# EAGLE design battery_charger (EAGLE 6.2)
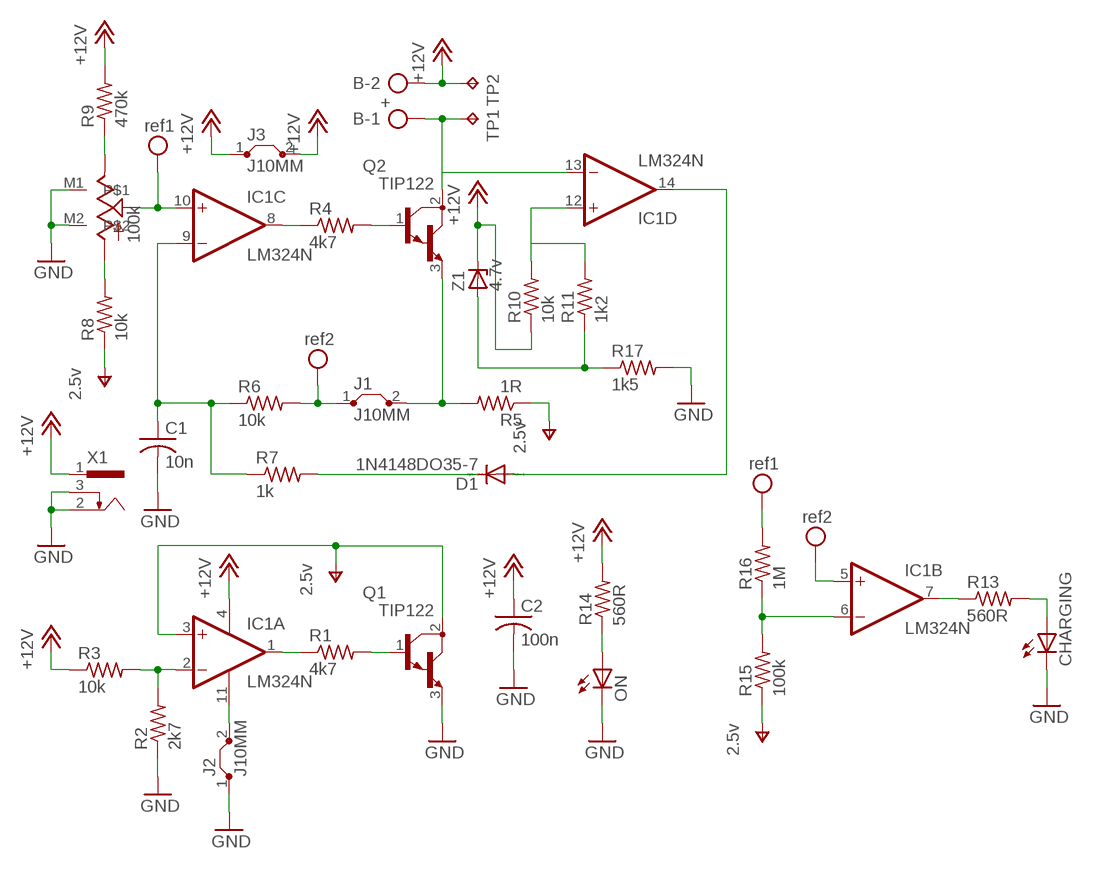
[diagram p0: schematic, sheet 1]

## Parts
B  +  AK500/2  [AK500/2]
C1  10n  C-US050-025X075  [C050-025X075]
C2  100n  C-US050-025X075  [C050-025X075]
CHARGING  LED5MM  [LED5MM]
D1  1N4148DO35-7  [DO35-7]
IC1  LM324N  [DIL14]
J1  J10MM  [10]
J2  J10MM  [10]
J3  J10MM  [10]
ON  LED5MM  [LED5MM]
Q1  TIP122  [TO220V]
Q2  TIP122  [TO220V]
R1  4k7  R-US_0207/7  [0207/7]
R2  2k7  R-US_0207/7  [0207/7]
R3  10k  R-US_0207/7  [0207/7]
R4  4k7  R-US_0207/7  [0207/7]
R5  1R  R-US_0922/22  [0922/22]
R6  10k  R-US_0207/7  [0207/7]
R7  1k  R-US_0207/7  [0207/7]
R8  10k  R-US_0207/7  [0207/7]
R9  470k  R-US_0207/7  [0207/7]
R10  10k  R-US_0207/7  [0207/7]
R11  1k2  R-US_0207/7  [0207/7]
R12  100k  US-EVUF3M  [EVUFXM]
R13  560R  R-US_0207/7  [0207/7]
R14  560R  R-US_0207/7  [0207/7]
R15  100k  R-US_0207/7  [0207/7]
R16  1M  R-US_0207/7  [0207/7]
R17  1k5  R-US_0207/7  [0207/7]
TP1  TPPAD1-13  [P1-13]
TP2  TPPAD1-13  [P1-13]
X1  733980-62  [733980-62]
Z1  4.7v  ZENER-DIODEDO34-7  [DO34Z7]

## Nets
+12V: B.2 C2.1 IC1.4(P:V+) J3.1 J3.2 R3.1 R9.2 R10.1 R14.2 TP2.TP X1.1 Z1.C
GND: C1.2 C2.2 CHARGING.K(C) J2.1 ON.K(C) Q1.3(E) R2.1 R12.M1 R12.M2 R17.2 X1.2 X1.3
N$1: IC1.1(A:OUT) R1.1
N$2: Q1.1(B) R1.2
N$3: IC1.8(C:OUT) R4.1
N$4: IC1.2(A:-IN) R2.2 R3.2
N$5: Q2.1(B) R4.2
N$6: ON.A R14.1
N$7: R11.1 R17.1 Z1.A
N$8: B.1 IC1.13(D:-IN) Q2.2(C) TP1.TP
N$9: C1.1 IC1.9(C:-IN) R6.1 R7.1
N$10: D1.C R7.2
N$11: D1.A IC1.14(D:OUT)
N$12: R8.2 R12.1(A)
N$13: CHARGING.A R13.2
N$14: R9.1 R12.3(E)
N$15: IC1.7(B:OUT) R13.1
N$16: IC1.6(B:-IN) R15.2 R16.1
N$21: IC1.11(P:V-) J2.2
N$22: J1.2 Q2.3(E) R5.2
N$23: IC1.12(D:+IN) R10.2 R11.2
V-: IC1.3(A:+IN) Q1.2(C) R5.1 R8.1 R15.1 ; supply symbol labelled 2.5v
VCC: IC1.10(C:+IN) R12.2(S) R16.2 ; supply symbol labelled ref1
VEE: IC1.5(B:+IN) J1.1 R6.2 ; supply symbol labelled ref2

## Library data of the parts
B = con-ptr500:AK500/2: CONNECTOR; OC_FARNELL: unknown; OC_NEWARK: unknown
C1 C2 = rcl:C-US: CAPACITOR, American symbol
CHARGING ON = led:LED: LED OSRAM: - CHIPLED LG R971, LG N971, LY N971, LG Q971, LY Q971, LO R971, LY R971 LH N974, LH R974 LS Q976, LO Q976, LY Q976 LO Q996 - Hyper CHIPLED LW Q18S LB Q993, LB Q99A, LB R99A - SideLED LS A670, LO A670, LY A670, LG A670, LP A670 LB A673, LV A673, LT A673, LW A673 LH A674 LY A675 LS A676, LA A676, LO A676, LY A676, LW A676 LS A679, LY A679, LG A679 - Hyper Micro SIDELED® LS Y876, LA Y876, LO Y876, LY Y876 LT Y87S - SmartLED LW L88C, LW L88S LB L89C, LB L89S, LG L890 LS L89K, LO L89K, LY L89K LS L896, LA L896, LO L896, LY L896 - TOPLED LS T670, LO T670, LY T670, LG T670, LP T670 LSG T670, LSP T670, LSY T670, LOP T670, LYG T670 LG T671, LOG T671, LSG T671 LB T673, LV T673, LT T673, LW T673 LH T674 LS T676, LA T676, LO T676, LY T676, LB T676, LH T676, LSB T676, LW T676 LB T67C, LV T67C, LT T67C, LS T67K, LO T67K, LY T67K, LW E67C LS E67B, LA E67B, LO E67B, LY E67B, LB E67C, LV E67C, LT E67C LW T67C LS T679, LY T679, LG T679 LS T770, LO T770, LY T770, LG T770, LP T770 LB T773, LV T773, LT T773, LW T773 LH T774 LS E675, LA E675, LY E675, LS T675 LS T776, LA T776, LO T776, LY T776, LB T776 LHGB T686 LT T68C, LB T68C - Hyper Mini TOPLED® LB M676 - Mini TOPLED Santana® LG M470 LS M47K, LO M47K, LY M47K Source: http://www.osram.convergy.de LUXEON: - LUMILED® LXK2-PW12-R00, LXK2-PW12-S00, LXK2-PW14-U00, LXK2-PW14-V00 LXK2-PM12-R00, LXK2-PM12-S00, LXK2-PM14-U00 LXK2-PE12-Q00, LXK2-PE12-R00, LXK2-PE12-S00, LXK2-PE14-T00, LXK2-PE14-U00 LXK2-PB12-K00, LXK2-PB12-L00, LXK2-PB12-M00, LXK2-PB14-N00, LXK2-PB14-P00, LXK2-PB14-Q00 LXK2-PR12-L00, LXK2-PR12-M00, LXK2-PR14-Q00, LXK2-PR14-R00 LXK2-PD12-Q00, LXK2-PD12-R00, LXK2-PD12-S00 LXK2-PH12-R00, LXK2-PH12-S00 LXK2-PL12-P00, LXK2-PL12-Q00, LXK2-PL12-R00 Source: www.luxeon.com KINGBRIGHT: KA-3528ASYC Source: www.kingbright.com
D1 = diode:1N4148: DIODE high speed (Philips)
IC1 = linear:LM324: OP AMP
J1-J3 = jumper:J: Bridge
Q1 Q2 = transistor-npn:TIP122*: NPN Darlington Transistor
R1-R11 R13-R17 = rcl:R-US_: RESISTOR, American symbol
R12 = pot:US-EVU: 9 mm Square Rotary Potentiometers Source: Panasonic
TP1 TP2 = testpad:TP: Test pad
X1 = con-conrad:73398?: FEMALE PRINT CONNECTOR Niedervolt-Steckverbinder Distributor Conrad
Z1 = diode:ZENER-DIODE: Z-Diode

## Board
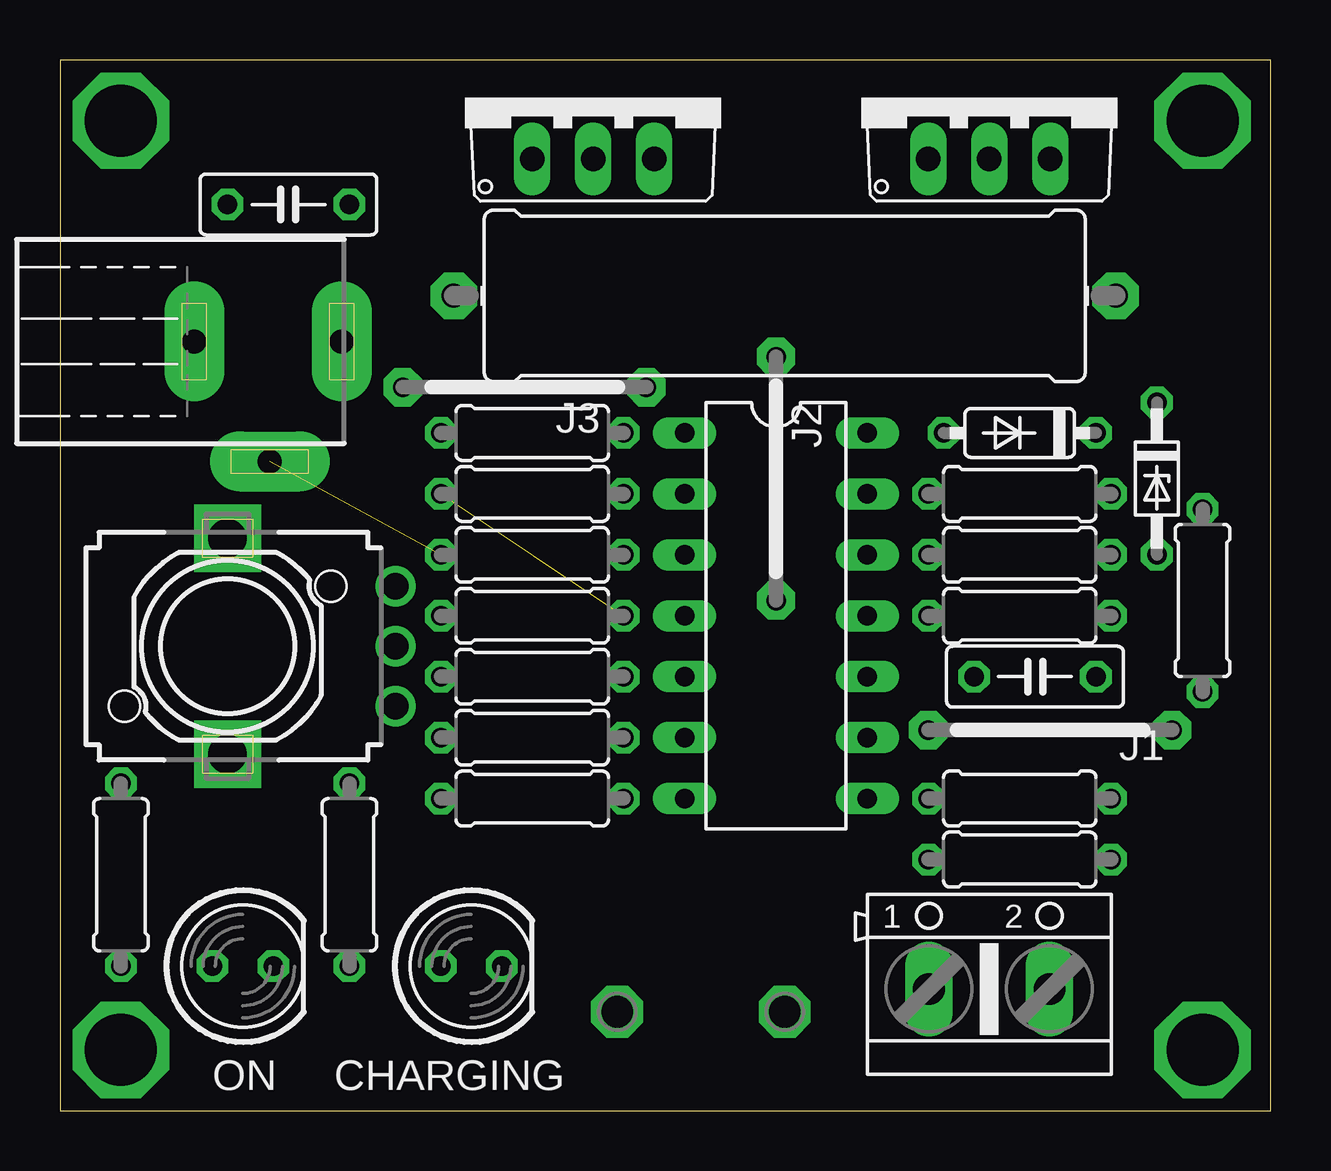
[diagram p1: board, top side]
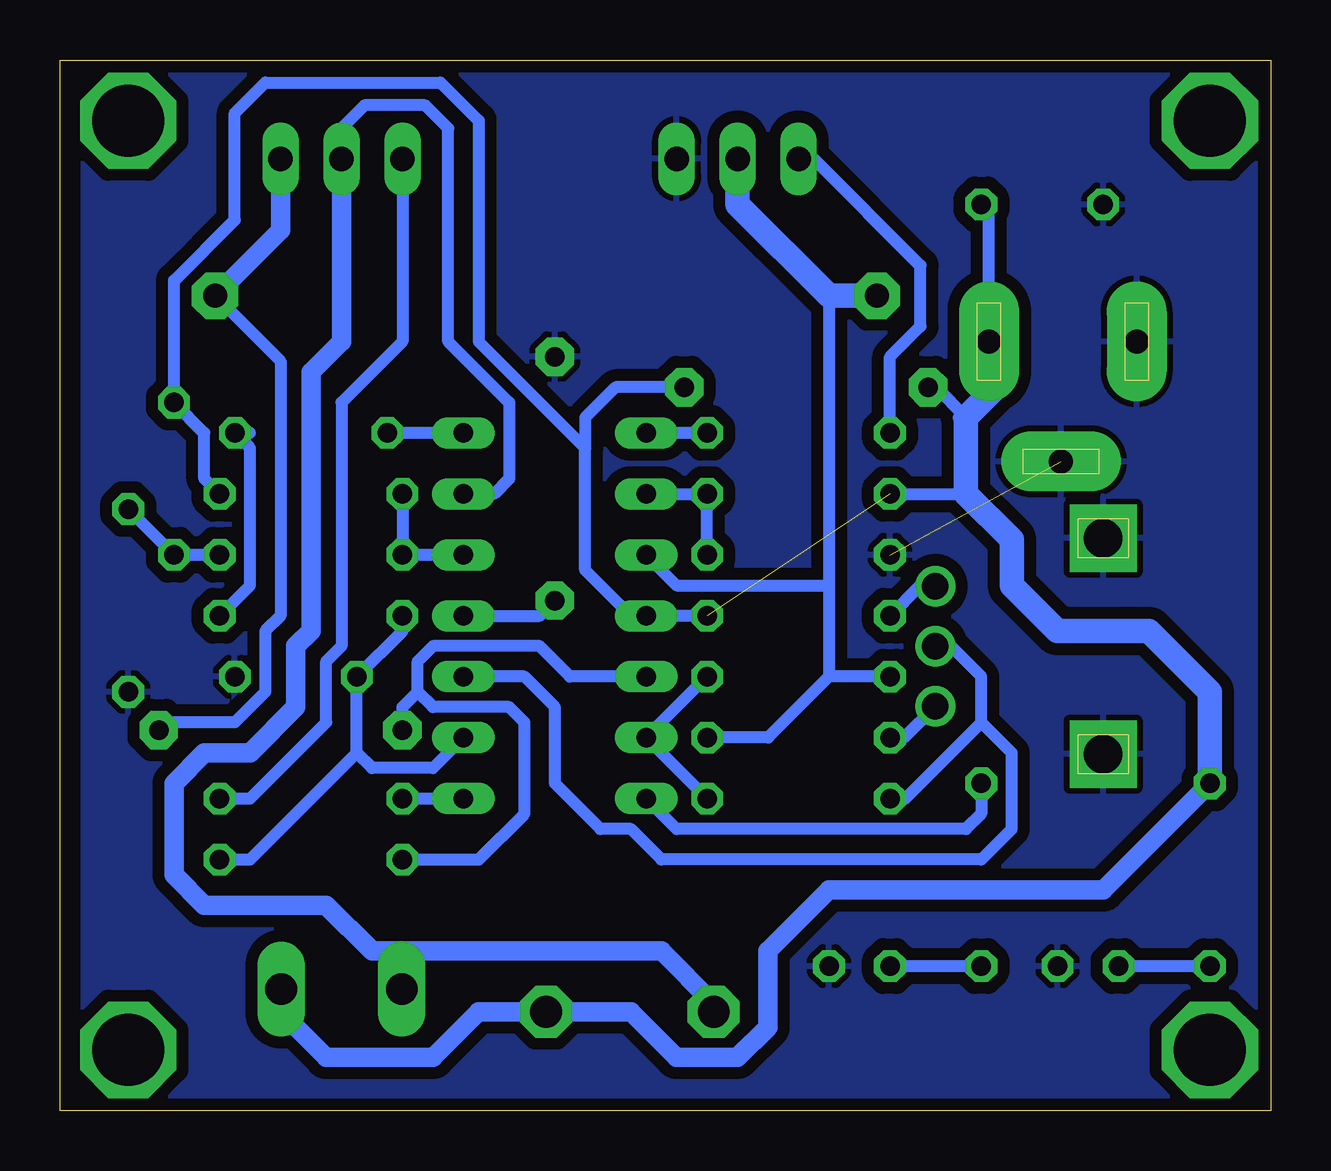
[diagram p2: board, bottom side, seen from below]

Size 50.47 x 43.8 mm. Coordinates in mm from the lower left corner, seen from the top.
Outline: 0,0 50.47,0 50.47,43.8 0,43.8 0,0
Copper layers (1*16): Top 0.035mm / dielectric 1.5mm / Bottom 0.035mm
Design rules: minimum track width 0.5mm, minimum drill 24mil, track to track 0.3mm, track to pad 0.3mm, pad to pad 0.3mm, via to via 0.3mm, smd to smd 8mil, copper to edge 0.5mm, drill to drill 8mil, minimum pad ring 10mil, minimum via ring 8mil, stop-mask expansion 4mil, vias tented up to drill 0mil, thermal gap 10mil

### Footprints (pad centres in the part's own frame; a part is rotated, then mirrored left to right if it is on the bottom)
AK500/2 = drill 1.321 long: 1 -2.515,0; 2 2.515,0
C050-025X075 = drill 0.813 octagon: 1 -2.54,0; 2 2.54,0
LED5MM = drill 0.813 octagon: A -1.27,0; K 1.27,0
DO35-7 = drill 0.813 octagon: A 3.175,0; C -3.175,0
DIL14 = drill 0.813 long: 1 -7.62,-3.81; 2 -5.08,-3.81; 3 -2.54,-3.81; 4 0,-3.81; 5 2.54,-3.81; 6 5.08,-3.81; 7 7.62,-3.81; 8 7.62,3.81; 9 5.08,3.81; 10 2.54,3.81; 11 0,3.81; 12 -2.54,3.81; 13 -5.08,3.81; 14 -7.62,3.81
10 = drill 0.813 pad 1.6 octagon: 1 -5.08,0; 2 5.08,0
TO220V = drill 1.016 long: 1 -2.54,-2.54; 2 0,-2.54; 3 2.54,-2.54
0207/7 = drill 0.813 octagon: 1 -3.81,0; 2 3.81,0
0922/22 = drill 1 pad 1.93 octagon: 1 -13.43,0; 2 14.16,0
EVUFXM = drill 1.1 pad 1.676: 1 -2.5,-7; 2 0,-7; 3 2.5,-7 | drill 1.6 pad 2.8 square: M1 4.5,0; M2 -4.5,0
P1-13 = drill 1.321 pad 2.159 octagon: TP 0,0
733980-62 = drill 1 pad 2.5 long: 1 0,8.57; 2 0,2.42; 3 5,5.57
DO34Z7 = drill 0.813 octagon: A 3.175,0; C -3.175,0

### Placement (x,y rotation side)
B  38.73,5.08 0 top
C1  40.64,18.1 0 top
C2  9.53,37.78 180 top
CHARGING  17.15,6.03 0 top
D1  40,28.26 180 top
IC1  29.85,20.64 270 top
J1  41.27,15.88 0 top
J2  29.85,26.35 270 top
J3  19.37,30.16 180 top
ON  7.62,6.03 0 top
Q1  22.23,42.23 0 top
Q2  38.73,42.23 0 top
R1  19.69,28.26 180 top
R2  19.69,23.18 0 top
R3  19.69,25.72 0 top
R4  40,13.02 0 top
R5  29.85,33.97 0 top
R6  40,10.48 180 top
R7  40,20.64 0 top
R8  19.69,15.56 180 top
R9  19.69,20.64 0 top
R10  40,25.72 180 top
R11  40,23.18 180 top
R12  6.98,19.37 90 top
R13  12.06,9.84 270 top
R14  2.54,9.84 90 top
R15  19.69,18.1 0 top
R16  19.69,13.02 180 top
R17  47.62,21.27 270 top
TP1  23.23,4.13 0 top
TP2  30.21,4.13 0 top
X1  3.17,32.07 270 top
Z1  45.72,26.35 270 top

### Tracks (layer width: path | path; a pad name or v marks a point on that pad's centre or on a via)
+12V  (1 unrouted)
  Bottom 0.5: X1.1 11.74,37.46 C2.1 | R3.1 12.7,25.72 | R10.1 44.45,26.35 44.45,28.26 Z1.C 45.72,34.61 43.18,37.15 43.18,41.59 41.91,42.86 34.61,42.86 33.02,41.27 33.02,32.07 28.58,27.62 | 28.58,27.62 28.58,22.54 26.67,20.64 IC1.4 R9.2 | 28.58,27.62 28.58,28.89 27.31,30.16 J3.1 | 13.02,28.89 12.7,28.89 13.97,30.16 J3.2
  Bottom 0.813: B.2 41.27,5.05 41.27,4.13 39.37,2.22 34.92,2.22 33.02,4.13 TP2.TP 26.67,4.13 24.77,2.22 22.23,2.22 20.96,3.49 20.96,6.67 18.42,9.21 6.98,9.21 R14.2
  Bottom 1.016: R14.2 2.54,17.46 5.08,20 8.89,20 10.79,21.91 10.79,23.81 12.7,25.72 12.7,28.89 11.43,30.16 11.43,31.75 X1.1
GND  (1 unrouted)
  pour Bottom (isolate 0.5): 0.64,43.18 49.53,43.18 49.53,0.63 0.64,0.63
N$1
  Bottom 0.5: R1.1 IC1.1
N$2
  Bottom 0.5: R1.2 15.88,31.43 14.61,32.7 14.61,35.24 19.05,39.69 Q1.1
N$3
  Bottom 0.5: R4.1 IC1.8
N$4
  Bottom 0.5: IC1.2 R3.2 R2.2
N$5
  Bottom 0.5: Q2.1 36.2,32.07 38.73,29.53 38.73,19.37 39.37,18.73 39.37,16.19 42.54,13.02 R4.2
N$6
  Bottom 0.5: R14.1 ON.A
N$7
  Bottom 0.5: R11.1 Z1.A R17.1
N$8
  Bottom 0.5: Q2.2 38.73,40.96 37.78,41.91 35.24,41.91 34.29,40.96 34.29,32.07 31.75,29.53 31.75,26.35 32.38,25.72 IC1.13
  Bottom 0.813: TP1.TP 23.23,4.49 25.4,6.67 35.56,6.67 | 35.56,6.67 36.2,6.03 36.2,5.11 B.1 | 35.56,6.67 37.46,6.67 39.37,8.57 44.45,8.57 45.72,9.84 45.72,13.65 44.45,14.92 42.54,14.92 40.64,16.83 40.64,19.37 40,20 40,30.8 38.73,32.07 Q2.2
N$9
  Bottom 0.5: R7.1 36.2,20 C1.1 38.1,14.92 | IC1.9 34.92,14.29 37.46,14.29 38.1,14.92 | R6.1 42.54,10.48 38.1,14.92
N$10
  Bottom 0.5: R7.2 42.54,21.91 42.54,27.62 D1.C 42.54,28.26
N$11
  Bottom 0.5: IC1.14 D1.A
N$12
  Bottom 0.5: R8.2 15.29,15.56 R12.1
N$13
  Bottom 0.5: R13.2 CHARGING.A
N$14
  Bottom 0.5: R12.3 14.64,21.87 R9.1
N$15
  Bottom 0.5: R13.1 12.06,12.38 12.7,11.75 24.77,11.75 IC1.7
N$16
  Bottom 0.5: R16.1 IC1.6 R15.2
N$17  (via drill 3)
  other vias: 47.62,2.54
N$18  (via drill 3)
  other vias: 2.54,2.54
N$19  (via drill 3)
  other vias: 47.62,41.27
N$20  (via drill 3)
  other vias: 2.54,41.27
N$21
  Bottom 0.5: IC1.11 30.48,20.64 J2.2
N$22
  Bottom 0.5: J1.2 46.04,16.19 43.18,16.19 41.91,17.46 41.91,20 41.27,20.64 41.27,31.24 R5.2
  Bottom 0.813: Q2.3 41.27,36.7 R5.2
N$23
  Bottom 0.5: R10.2 R11.2 IC1.12
V-
  Bottom 0.5: R15.1 18.42,18.1 | 18.42,18.1 20.96,15.56 R8.1 | 18.42,33.97 18.42,21.91 | 18.42,21.91 18.42,18.1 | IC1.3 24.77,21.91 18.42,21.91
  Bottom 1.016: R5.1 18.42,33.97 22.23,37.78 Q1.2
VCC
  Bottom 0.5: R16.2 15.24,13.02 12.06,16.19 | IC1.10 31.12,18.1 29.85,16.83 29.85,13.65 27.94,11.75 26.67,11.75 25.4,10.48 12.06,10.48 10.79,11.75 10.79,14.92 12.06,16.19 | 12.06,16.19 12.06,18.1 13.33,19.37 R12.2
VEE
  Bottom 0.5: 35.56,17.46 34.92,16.83 31.75,16.83 31.12,16.19 31.12,12.38 33.02,10.48 R6.2 | 35.56,17.46 35.56,18.73 34.92,19.37 30.48,19.37 29.21,18.1 IC1.5 | J1.1 36.2,16.83 35.56,17.46